# EAGLE design Adapter (EAGLE 9.6.2)
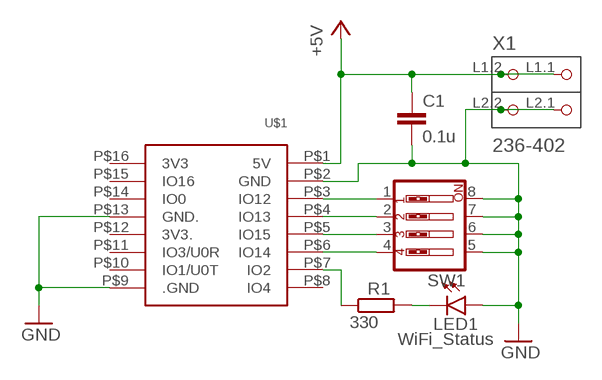
[diagram p0: schematic, sheet 1]

## Parts
C1  0.1u  C-EU050-030X075  [C050-030X075]
LED1  WiFi_Status  TLLG4400  [LED3MM]
R1  330  R-EU_0204/2V  [0204V]
SW1  SW_DIP-4  [EDG-04]
U$1  ESP32-CAM  [ESP32-CAM]
X1  236-402  [P-236-402]

## Nets
+5V: C1.1 U$1.P$1(5V) X1.L1.1(P1.1) X1.L1.2(P1.2)
GND: C1.2 LED1.A SW1.5 SW1.6 SW1.7 SW1.8 U$1.P$2(GND) U$1.P$9(.GND) U$1.P$13(GND.) X1.L2.1(P2.1) X1.L2.2(P2.2)
N$1: SW1.1 U$1.P$3(IO12)
N$2: SW1.2 U$1.P$4(IO13)
N$3: SW1.3 U$1.P$5(IO15)
N$4: SW1.4 U$1.P$6(IO14)
N$5: R1.1 U$1.P$7(IO2)
N$6: LED1.K(C) R1.2
Unconnected: U$1.P$8(IO4) U$1.P$10(IO1/U0T) U$1.P$11(IO3/U0R) U$1.P$12(3V3.) U$1.P$14(IO0) U$1.P$15(IO16) U$1.P$16(3V3)

## Library data of the parts
C1 = rcl:C-EU: CAPACITOR, European symbol; SPICEPREFIX: C
LED1 = led:TLLG4400: Low Current (2mA) LED 3 mm Tinted Diffused Package color GREEN Source: Data sheet <http://www.farnell.com/datasheets/391098.pdf>; MF: VISHAY SEMICONDUCTOR; OC_FARNELL: 1612435
R1 = rcl:R-EU_: RESISTOR, European symbol; SPICEPREFIX: R
SW1 = special:SW_DIP-4: DIP SWITCH
U$1 = ESP32-CAM:ESP32-CAM: Check prices <https://pricing.snapeda.com/parts/ESP32-CAM/AI-Thinker/view-part?ref=eda>; AVAILABILITY: Not in stock; DESCRIPTION: ESP32 ESP32 Transceiver; 802.11 a/b/g/n (Wi-Fi, WiFi, WLAN), Bluetooth® Smart 4.x Low Energy (BLE) Evaluation Board; MF: AI-Thinker; MP: ESP32-CAM; PACKAGE: Package; PRICE: None
X1 = con-wago_236:236-402: Serie 236, Klemmenleiste für Leiterplatten 2 Lötstifte/Pol / Series 236, PCB terminal strip 2 solder pins/pole Polzahl / Pole No.: 2 Rastermaß / Pitch: 5.08 mm Bemessungsspannung / Rated Voltage: 320 V Nennstrom / Nominal Current: 24 A Leiterquerschnitt / Conductor Size: 0.08 - 2.5 mm² Anschlusstechnik / Connection Technology: CAGE CLAMP® Lötstiftlänge: / Solder Pin Length: 4 mm Leitereinführung (zur Platine) / Conductor entry angle (to PCB): 45 ° Farbe / Color: grau / gray Stand: 01.01.2012. Die jeweils aktuellen Daten zu diesem Artikel finden Sie in unserem Produktkatalog, den Sie unter www.wago.com einsehen können. As of: 01/01/2012. Please find the newest data for this article in our product catalogue, which can be viewed under www.wago.com.

## Board
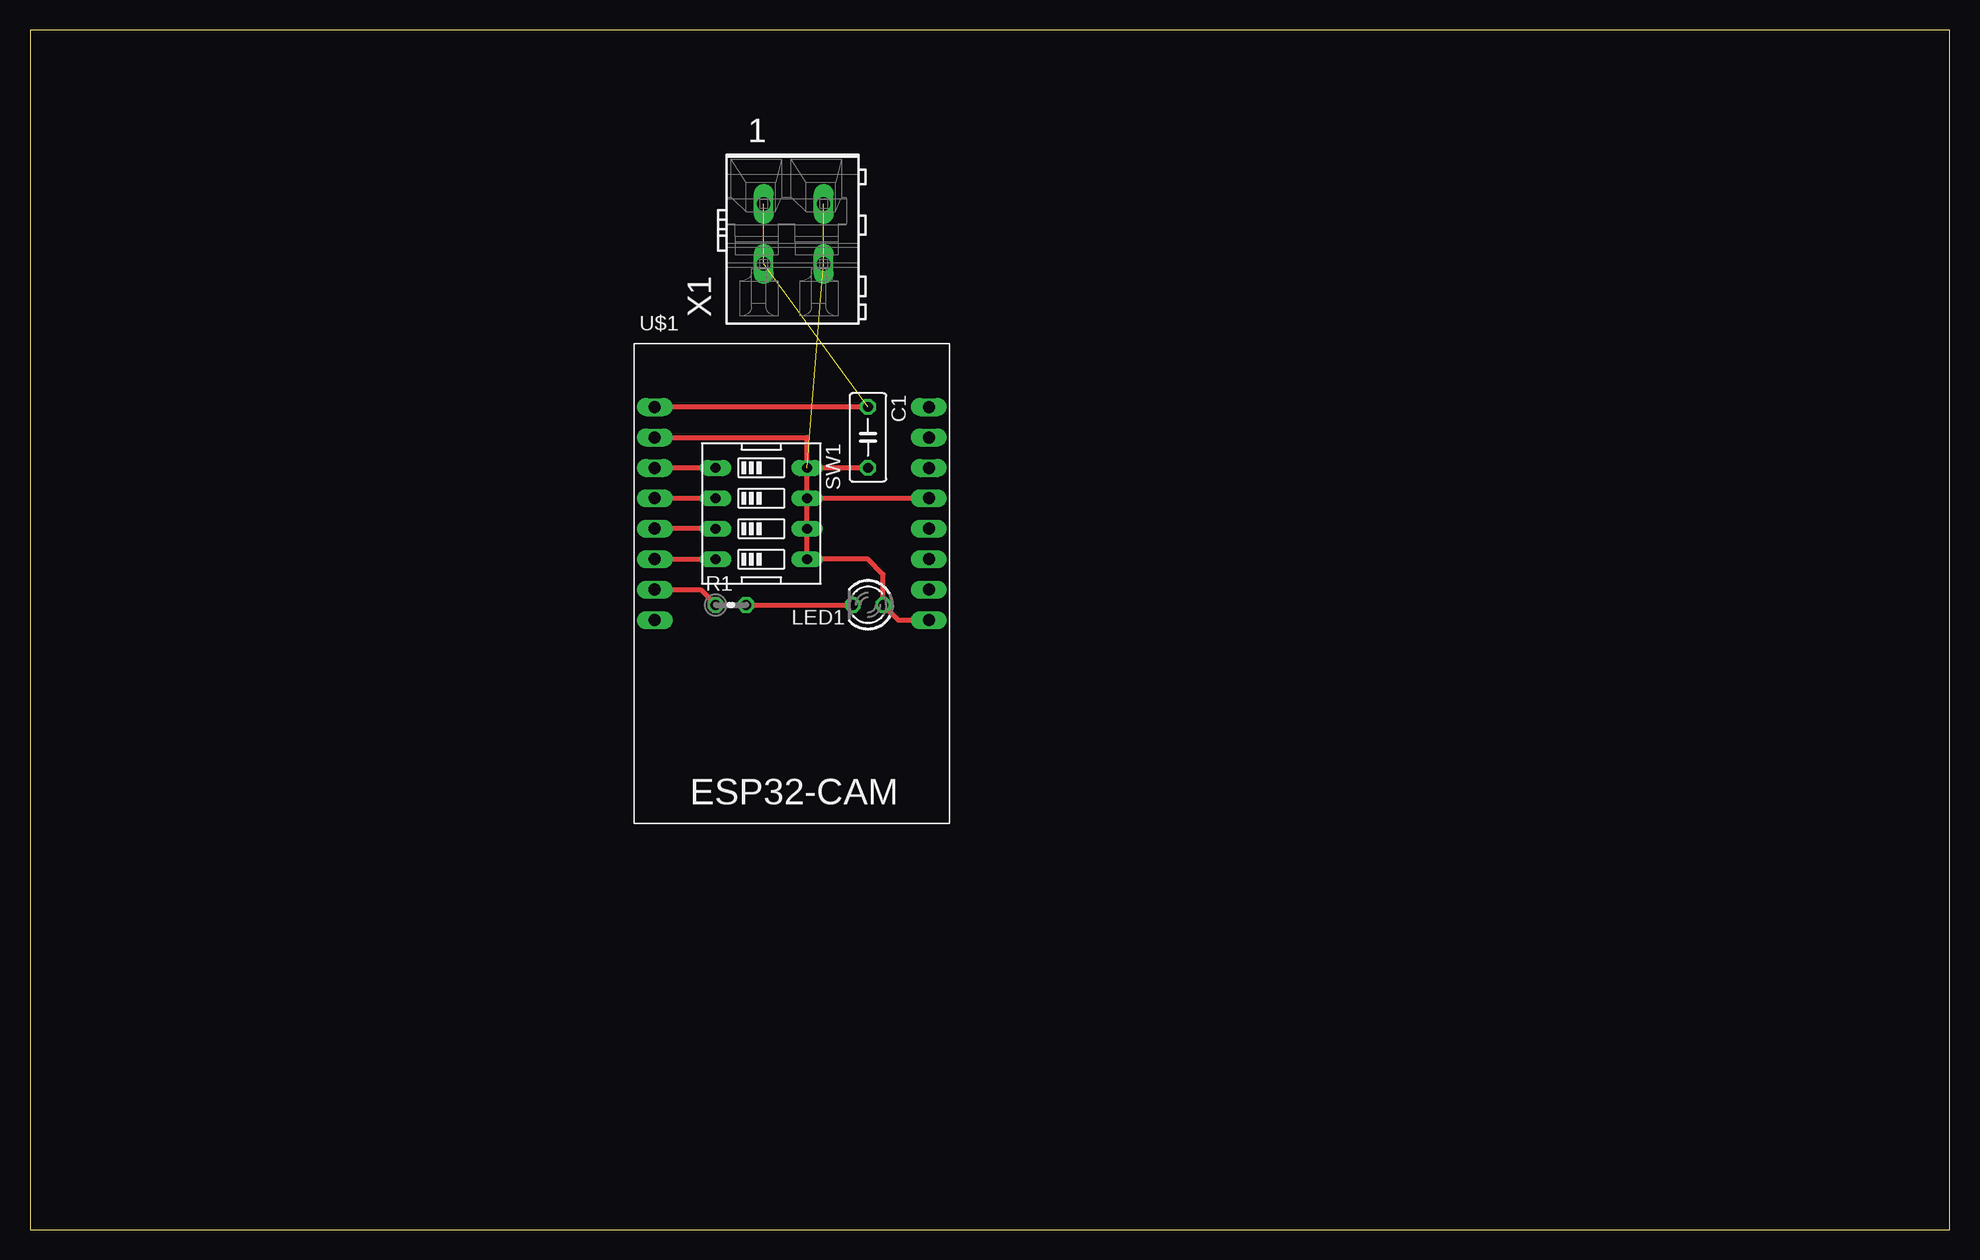
[diagram p1: board, top side]

Size 160 x 100 mm. Coordinates in mm from the lower left corner, seen from the top.
Outline: 0,0 160,0 160,100 0,100 0,0
Copper layers (1*16): Top 0.035mm / dielectric 1.5mm / Bottom 0.035mm
Design rules "default": minimum track width 6mil, minimum drill 0.35mm, track to track 6mil, track to pad 6mil, pad to pad 6mil, via to via 6mil, smd to smd 6mil, copper to edge 40mil, drill to drill 6mil, minimum pad ring 10mil, minimum via ring 8mil, stop-mask expansion 4mil, vias tented up to drill 0mil, thermal gap 10mil

### Footprints (pad centres in the part's own frame; a part is rotated, then mirrored left to right if it is on the bottom)
C050-030X075 = drill 0.813 octagon: 1 -2.54,0; 2 2.54,0
LED3MM = drill 0.813 octagon: A -1.27,0; K 1.27,0
0204V = drill 0.813 octagon: 1 -1.27,0; 2 1.27,0
EDG-04 = drill 0.813 long: 1 -3.81,-3.81; 2 -1.27,-3.81; 3 1.27,-3.81; 4 3.81,-3.81; 5 3.81,3.81; 6 1.27,3.81; 7 -1.27,3.81; 8 -3.81,3.81
ESP32-CAM = drill 1 pad 1.422 long: P$1 -11.43,10.16; P$2 -11.43,7.62; P$3 -11.43,5.08; P$4 -11.43,2.54; P$5 -11.43,0; P$6 -11.43,-2.54; P$7 -11.43,-5.08; P$8 -11.43,-7.62; P$9 11.43,-7.62; P$10 11.43,-5.08; P$11 11.43,-2.54; P$12 11.43,0; P$13 11.43,2.54; P$14 11.43,5.08; P$15 11.43,7.62; P$16 11.43,10.16
P-236-402 = drill 1.1 long: L1.1 2.957,2.35; L1.2 -2.043,2.35; L2.1 2.957,-2.65; L2.2 -2.043,-2.65

### Placement (x,y rotation side)
C1  69.85,66.04 270 top
LED1  69.85,52.07 180 top
R1  58.42,52.07 0 top
SW1  60.96,59.69 270 top
U$1  63.5,58.42 0 top
X1  63.5,82.55 90 top

### Tracks (layer width: path | path; a pad name or v marks a point on that pad's centre or on a via)
+5V  (2 unrouted)
  Top 0.406: C1.1 U$1.P$1
GND  (2 unrouted)
  Top 0.406: U$1.P$2 64.77,66.04 SW1.8 | SW1.7 SW1.6 SW1.5 69.85,55.88 71.12,54.61 LED1.A 72.39,50.8 U$1.P$9 | SW1.7 SW1.8 | SW1.7 U$1.P$13 | C1.2 SW1.8
N$1
  Top 0.406: SW1.1 U$1.P$3
N$2
  Top 0.406: U$1.P$4 SW1.2
N$3
  Top 0.406: SW1.3 U$1.P$5
N$4
  Top 0.406: U$1.P$6 SW1.4
N$5
  Top 0.406: R1.1 55.88,53.34 U$1.P$7
N$6
  Top 0.406: R1.2 LED1.K